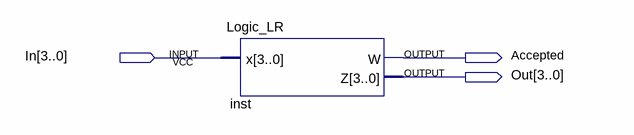
[diagram p0: schematic sheet]
// Quartus schematic LR_Machine.bdf as structural Verilog: 1 symbols, 3 pins
module LR_Machine (
  input  [3:0] In,
  output Accepted,
  output [3:0] Out
);

  Logic_LR inst (.x(In), .W(Accepted), .Z(Out));
endmodule
